# Altium schematic sheet interface.SchDoc
size A4; SheetNumber: 9; SheetTotal: 9; SPICEModelCacheBYCDXEOE: <root> / <DocumentId>BYCDXEOE</DocumentId> / <CacheFrame Number="0"> / <Model Name="1206_156120rs82500" Kind="CKT"> / <Text>****** / .subckt 1206_156120RS82500  1  2 / D1 1 2 SMRW / .MODEL SMRW D / + IS=404.38E-18 / + N=2.1466 / + RS=.75545 / + IKF=193.03E-6 / + CJO=1.0000E-12 / + M=.3333 / + VJ=.75 / + BV=5 / + IBV=100.00E-6 / + TT=5.0000E-9 / .ends</Text> / </Model> / </CacheFrame> / </root>
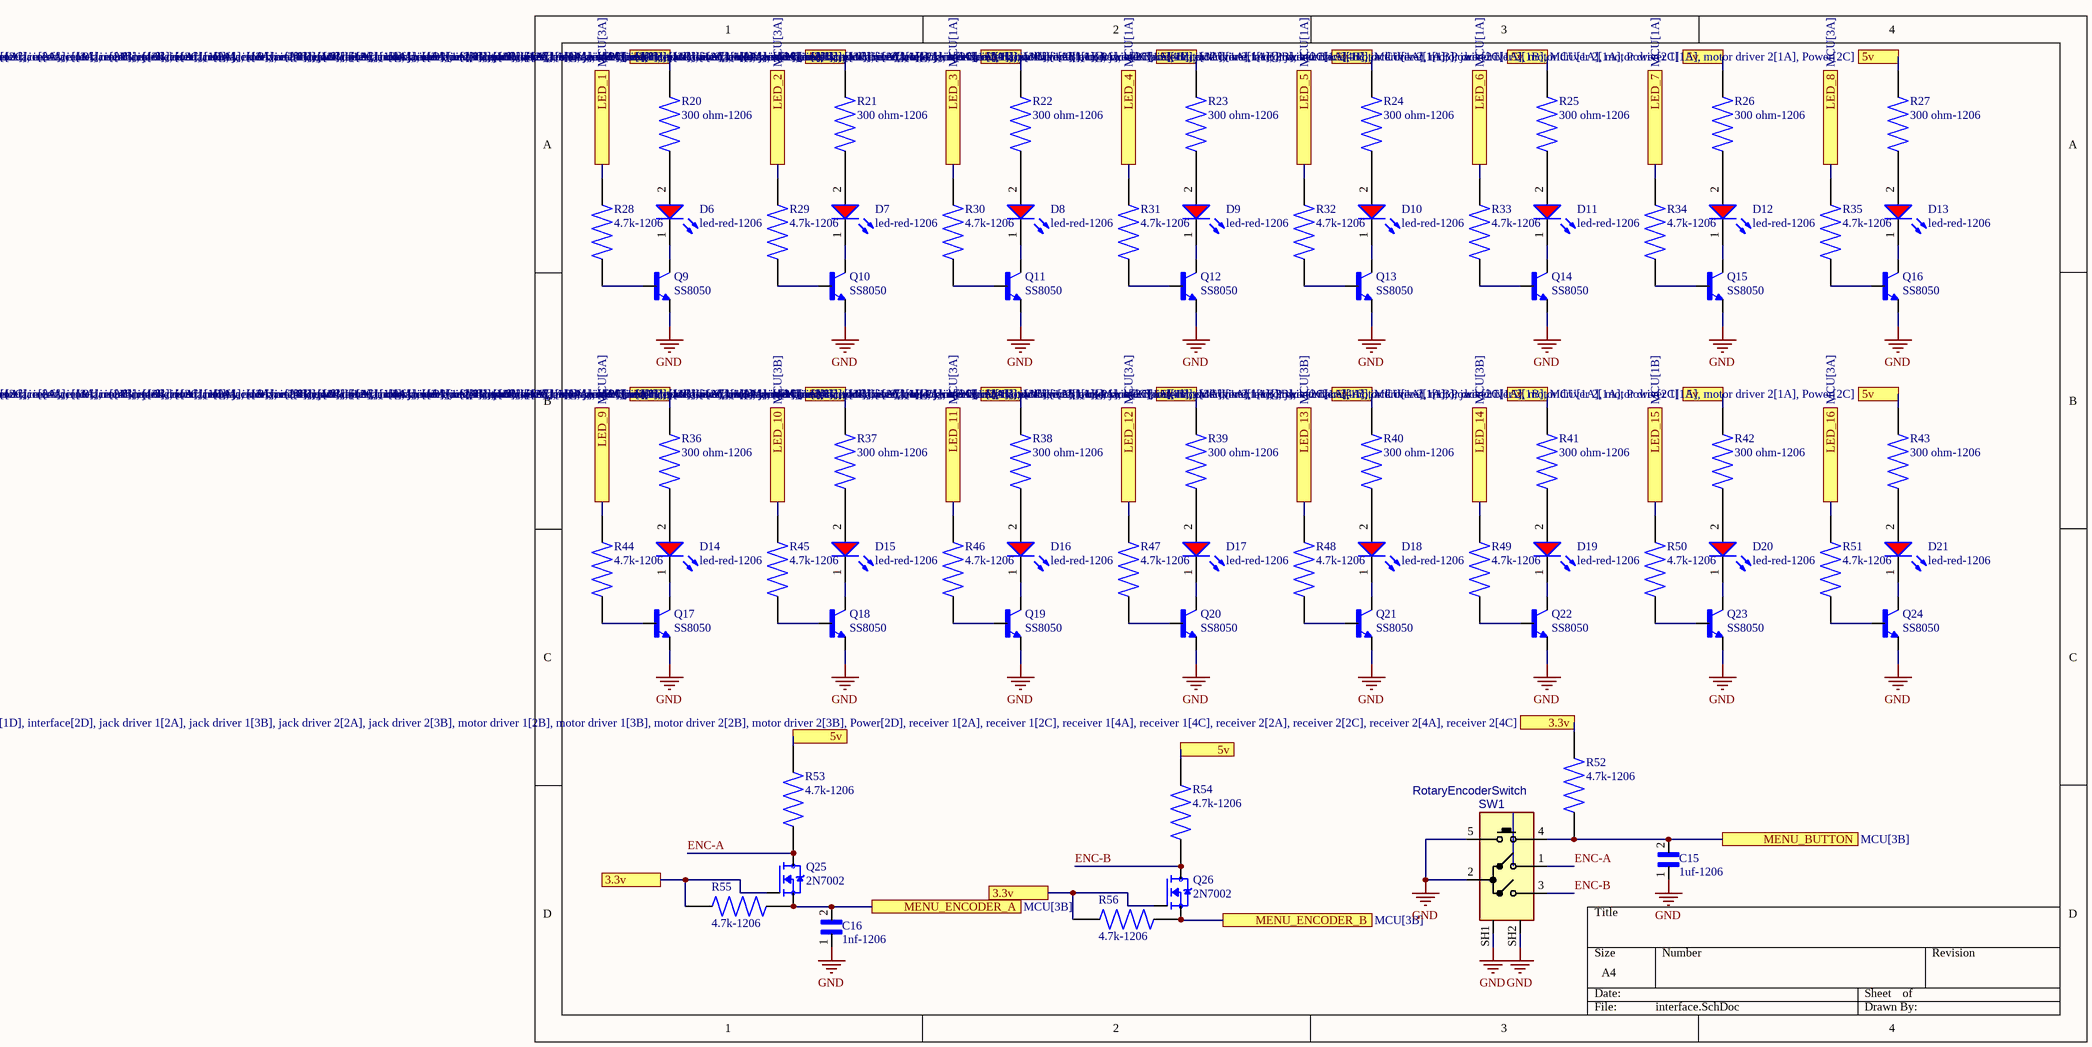
[diagram p0: interface.SchDoc]

## Parts
C15  1uf-1206  [CAPC3216X180N]
C16  1nf-1206  [CAPC3216X180N]
D6  led-red-1206  [WL-SMRW_1206 dome_normal use]
D7  led-red-1206  [WL-SMRW_1206 dome_normal use]
D8  led-red-1206  [WL-SMRW_1206 dome_normal use]
D9  led-red-1206  [WL-SMRW_1206 dome_normal use]
D10  led-red-1206  [WL-SMRW_1206 dome_normal use]
D11  led-red-1206  [WL-SMRW_1206 dome_normal use]
D12  led-red-1206  [WL-SMRW_1206 dome_normal use]
D13  led-red-1206  [WL-SMRW_1206 dome_normal use]
D14  led-red-1206  [WL-SMRW_1206 dome_normal use]
D15  led-red-1206  [WL-SMRW_1206 dome_normal use]
D16  led-red-1206  [WL-SMRW_1206 dome_normal use]
D17  led-red-1206  [WL-SMRW_1206 dome_normal use]
D18  led-red-1206  [WL-SMRW_1206 dome_normal use]
D19  led-red-1206  [WL-SMRW_1206 dome_normal use]
D20  led-red-1206  [WL-SMRW_1206 dome_normal use]
D21  led-red-1206  [WL-SMRW_1206 dome_normal use]
Q9  SS8050  [TRANS_SS8050-G]
Q10  SS8050  [TRANS_SS8050-G]
Q11  SS8050  [TRANS_SS8050-G]
Q12  SS8050  [TRANS_SS8050-G]
Q13  SS8050  [TRANS_SS8050-G]
Q14  SS8050  [TRANS_SS8050-G]
Q15  SS8050  [TRANS_SS8050-G]
Q16  SS8050  [TRANS_SS8050-G]
Q17  SS8050  [TRANS_SS8050-G]
Q18  SS8050  [TRANS_SS8050-G]
Q19  SS8050  [TRANS_SS8050-G]
Q20  SS8050  [TRANS_SS8050-G]
Q21  SS8050  [TRANS_SS8050-G]
Q22  SS8050  [TRANS_SS8050-G]
Q23  SS8050  [TRANS_SS8050-G]
Q24  SS8050  [TRANS_SS8050-G]
Q25  2N7002  [SOT95P240X111-3N]
Q26  2N7002  [SOT95P240X111-3N]
R20  300 ohm-1206  [RESC3015X65N]
R21  300 ohm-1206  [RESC3015X65N]
R22  300 ohm-1206  [RESC3015X65N]
R23  300 ohm-1206  [RESC3015X65N]
R24  300 ohm-1206  [RESC3015X65N]
R25  300 ohm-1206  [RESC3015X65N]
R26  300 ohm-1206  [RESC3015X65N]
R27  300 ohm-1206  [RESC3015X65N]
R28  4.7k-1206  [RESC3015X65N]
R29  4.7k-1206  [RESC3015X65N]
R30  4.7k-1206  [RESC3015X65N]
R31  4.7k-1206  [RESC3015X65N]
R32  4.7k-1206  [RESC3015X65N]
R33  4.7k-1206  [RESC3015X65N]
R34  4.7k-1206  [RESC3015X65N]
R35  4.7k-1206  [RESC3015X65N]
R36  300 ohm-1206  [RESC3015X65N]
R37  300 ohm-1206  [RESC3015X65N]
R38  300 ohm-1206  [RESC3015X65N]
R39  300 ohm-1206  [RESC3015X65N]
R40  300 ohm-1206  [RESC3015X65N]
R41  300 ohm-1206  [RESC3015X65N]
R42  300 ohm-1206  [RESC3015X65N]
R43  300 ohm-1206  [RESC3015X65N]
R44  4.7k-1206  [RESC3015X65N]
R45  4.7k-1206  [RESC3015X65N]
R46  4.7k-1206  [RESC3015X65N]
R47  4.7k-1206  [RESC3015X65N]
R48  4.7k-1206  [RESC3015X65N]
R49  4.7k-1206  [RESC3015X65N]
R50  4.7k-1206  [RESC3015X65N]
R51  4.7k-1206  [RESC3015X65N]
R52  4.7k-1206  [RESC3015X65N]
R53  4.7k-1206  [RESC3015X65N]
R54  4.7k-1206  [RESC3015X65N]
R55  4.7k-1206  [RESC3015X65N]
R56  4.7k-1206  [RESC3015X65N]
SW1  RotaryEncoderSwitch  [SWROT_11MM]

## Ports
3.3v (see interface[1D], interface[2D], jack driver 1[2A], jack driver 1[3B], jack driver 2[2A], jack driver 2[3B], motor driver 1[2B], motor driver 1[3B], motor driver 2[2B], motor driver 2[3B], Power[2D], receiver 1[2A], receiver 1[2C], receiver 1[4A], receiver 1[4C], receiver 2[2A], receiver 2[2C], receiver 2[4A], receiver 2[4C]), 3.3v (see interface[1D], interface[3C], jack driver 1[2A], jack driver 1[3B], jack driver 2[2A], jack driver 2[3B], motor driver 1[2B], motor driver 1[3B], motor driver 2[2B], motor driver 2[3B], Power[2D], receiver 1[2A], receiver 1[2C], receiver 1[4A], receiver 1[4C], receiver 2[2A], receiver 2[2C], receiver 2[4A], receiver 2[4C]), 3.3v (see interface[2D], interface[3C], jack driver 1[2A], jack driver 1[3B], jack driver 2[2A], jack driver 2[3B], motor driver 1[2B], motor driver 1[3B], motor driver 2[2B], motor driver 2[3B], Power[2D], receiver 1[2A], receiver 1[2C], receiver 1[4A], receiver 1[4C], receiver 2[2A], receiver 2[2C], receiver 2[4A], receiver 2[4C]), 5v (see interface[1A], interface[1B], interface[1C], interface[2A], interface[2B], interface[2C], interface[3A], interface[3B], interface[4A], interface[4B], jack driver 1[1B], jack driver 2[1B], MCU[1A], motor driver 1[1A], motor driver 2[1A], Power[2C]), 5v (see interface[1A], interface[1B], interface[1C], interface[2A], interface[2B], interface[2C], interface[3A], interface[3B], interface[4A], jack driver 1[1B], jack driver 2[1B], MCU[1A], motor driver 1[1A], motor driver 2[1A], Power[2C]), 5v (see interface[1A], interface[1B], interface[1C], interface[2A], interface[2B], interface[2C], interface[3A], interface[3B], interface[4B], jack driver 1[1B], jack driver 2[1B], MCU[1A], motor driver 1[1A], motor driver 2[1A], Power[2C]), 5v (see interface[1A], interface[1B], interface[1C], interface[2A], interface[2B], interface[3A], interface[3B], interface[4A], interface[4B], jack driver 1[1B], jack driver 2[1B], MCU[1A], motor driver 1[1A], motor driver 2[1A], Power[2C]), 5v (see interface[1A], interface[1B], interface[2A], interface[2B], interface[2C], interface[3A], interface[3B], interface[4A], interface[4B], jack driver 1[1B], jack driver 2[1B], MCU[1A], motor driver 1[1A], motor driver 2[1A], Power[2C]), LED_1 (see MCU[3A]), LED_2 (see MCU[3A]), LED_3 (see MCU[1A]), LED_4 (see MCU[1A]), LED_5 (see MCU[1A]), LED_6 (see MCU[1A]), LED_7 (see MCU[1A]), LED_8 (see MCU[3A]), LED_9 (see MCU[3A]), LED_10 (see MCU[3B]), LED_11 (see MCU[3A]), LED_12 (see MCU[3A]), LED_13 (see MCU[3B]), LED_14 (see MCU[3B]), LED_15 (see MCU[1B]), LED_16 (see MCU[3A]), MENU_BUTTON (see MCU[3B]), MENU_ENCODER_A (see MCU[3B]), MENU_ENCODER_B (see MCU[3B])

## Nets
GND: C15.1 C16.1 Q9.2(E) Q10.2(E) Q11.2(E) Q12.2(E) Q13.2(E) Q14.2(E) Q15.2(E) Q16.2(E) Q17.2(E) Q18.2(E) Q19.2(E) Q20.2(E) Q21.2(E) Q22.2(E) Q23.2(E) Q24.2(E) SW1.2(C) SW1.5(D) SW1.SH1 SW1.SH2
3.3v: Q25.1(G) Q26.1(G) R52.2 R55.1 R56.2 ; port 3.3v
5v: R20.2 R21.2 R22.2 R23.2 R24.2 R25.2 R26.2 R27.2 R36.2 R37.2 R38.2 R39.2 R40.2 R41.2 R42.2 R43.2 R53.2 R54.2 ; port 5v
ENC-A: Q25.3(D) R53.1 SW1.1(A)
ENC-B: Q26.3(D) R54.1 SW1.3(B)
LED_1: R28.2 ; port LED_1
LED_2: R29.2 ; port LED_2
LED_3: R30.2 ; port LED_3
LED_4: R31.2 ; port LED_4
LED_5: R32.2 ; port LED_5
LED_6: R33.2 ; port LED_6
LED_7: R34.2 ; port LED_7
LED_8: R35.2 ; port LED_8
LED_9: R44.2 ; port LED_9
LED_10: R45.2 ; port LED_10
LED_11: R46.2 ; port LED_11
LED_12: R47.2 ; port LED_12
LED_13: R48.2 ; port LED_13
LED_14: R49.2 ; port LED_14
LED_15: R50.2 ; port LED_15
LED_16: R51.2 ; port LED_16
MENU_BUTTON: C15.2 R52.1 SW1.4(E) ; port MENU_BUTTON
MENU_ENCODER_A: C16.2 Q25.2(S) R55.2 ; port MENU_ENCODER_A
MENU_ENCODER_B: Q26.2(S) R56.1 ; port MENU_ENCODER_B
NetD6_1: D6.1(K) Q9.3(C)
NetD6_2: D6.2(A) R20.1
NetD7_1: D7.1(K) Q10.3(C)
NetD7_2: D7.2(A) R21.1
NetD8_1: D8.1(K) Q11.3(C)
NetD8_2: D8.2(A) R22.1
NetD9_1: D9.1(K) Q12.3(C)
NetD9_2: D9.2(A) R23.1
NetD10_1: D10.1(K) Q13.3(C)
NetD10_2: D10.2(A) R24.1
NetD11_1: D11.1(K) Q14.3(C)
NetD11_2: D11.2(A) R25.1
NetD12_1: D12.1(K) Q15.3(C)
NetD12_2: D12.2(A) R26.1
NetD13_1: D13.1(K) Q16.3(C)
NetD13_2: D13.2(A) R27.1
NetD14_1: D14.1(K) Q17.3(C)
NetD14_2: D14.2(A) R36.1
NetD15_1: D15.1(K) Q18.3(C)
NetD15_2: D15.2(A) R37.1
NetD16_1: D16.1(K) Q19.3(C)
NetD16_2: D16.2(A) R38.1
NetD17_1: D17.1(K) Q20.3(C)
NetD17_2: D17.2(A) R39.1
NetD18_1: D18.1(K) Q21.3(C)
NetD18_2: D18.2(A) R40.1
NetD19_1: D19.1(K) Q22.3(C)
NetD19_2: D19.2(A) R41.1
NetD20_1: D20.1(K) Q23.3(C)
NetD20_2: D20.2(A) R42.1
NetD21_1: D21.1(K) Q24.3(C)
NetD21_2: D21.2(A) R43.1
NetQ9_1: Q9.1(B) R28.1
NetQ10_1: Q10.1(B) R29.1
NetQ11_1: Q11.1(B) R30.1
NetQ12_1: Q12.1(B) R31.1
NetQ13_1: Q13.1(B) R32.1
NetQ14_1: Q14.1(B) R33.1
NetQ15_1: Q15.1(B) R34.1
NetQ16_1: Q16.1(B) R35.1
NetQ17_1: Q17.1(B) R44.1
NetQ18_1: Q18.1(B) R45.1
NetQ19_1: Q19.1(B) R46.1
NetQ20_1: Q20.1(B) R47.1
NetQ21_1: Q21.1(B) R48.1
NetQ22_1: Q22.1(B) R49.1
NetQ23_1: Q23.1(B) R50.1
NetQ24_1: Q24.1(B) R51.1

## Library data of the parts
C15 C16 = CGA5L3X8R1H105M160AB: 1ÂµF Â±20% 50V Ceramic Capacitor X8R 1206 (3216 Metric); MF: TDK; Value: *; Purchase-URL: https://pricing.snapeda.com/search/part/CGA5L3X8R1H105M160AB/?ref=eda; Package: 3216 TDK; Availability: In Stock; SnapEDA_Link: https://www.snapeda.com/parts/CGA5L3X8R1H105M160AB/TDK/view-part/?ref=snap; MP: CGA5L3X8R1H105M160AB; Check_prices: https://www.snapeda.com/parts/CGA5L3X8R1H105M160AB/TDK/view-part/?ref=eda; Price: None
D6-D21 = 156120RS82500: WL-SMRW Mono-color Reverse mount Waterclear, SMT, size 1206 dome, Red, 2V, 20°; Manufacturer: Wurth Elektronik; Chip Technology: AlInGaP; Dominant Wavelength: 624nm; Luminous Intensity: 1100mcd; Peak Wavelength: 632nm; Manufacturer Part Number: 156120RS82500; Category: Signal LEDs; Match Code: WL-SMRW; ComponentLink1Description: Website Link; ComponentLink1URL: https://www.we-online.com/redexpert/article/156120RS82500?ad; ComponentLink2Description: Datasheet Link; ComponentLink2URL: https://www.we-online.com/redexpert/spec/156120RS82500?ad; Mount: Surface Mount; Operating Temperature Max: 85°C; Operating Temperature Min: -40°C; Packaging: Tape and Reel; Case/Size Code: 1206 dome; Length: 3.2mm; Width: 1.6mm; Height: 1.85mm; Emitting Color: Red; Forward Voltage: 2V; Viewing Angle: 20°
Q9-Q24 = SS8050-G: Bipolar (BJT) Transistor NPN 25 V 1.5 A 100MHz 300 mW Surface Mount SOT-23-3; MP: SS8050G; MF: Comchip; Digi-Key_Part_Number: 641-1790-2-ND; Check_prices: https://www.snapeda.com/parts/SS8050G/Comchip/view-part/?ref=eda; Package: None; SnapEDA_Link: https://www.snapeda.com/parts/SS8050G/Comchip/view-part/?ref=snap; Value: *
Q25 Q26 = 2N7002: N-Channel 60V 280mA (Ta) 350mW (Ta) Surface Mount SOT-23-3 (TO-236); MF: {'manufacturer': u'onsemi'}; Package: None; Price: None; Value: *; MP: 2N7002; Availability: Unavailable
R20-R56 = CPF1206B10KE1: Res Thin Film 1206 10K Ohm 0.1% 1/8W Â±25ppm/Â°C Molded SMD SMD Paper T/R; Power_Rating: .125 W; MF: TE Connectivity; Voltage_Rating: 150 V; Tolerance: .1%; SnapEDA_Link: https://www.snapeda.com/parts/CPF1206B10KE1/TE+Connectivity/view-part/?ref=snap; Package: 1206; Resistance: 10K; Value: *; MP: CPF1206B10KE1; EU_RoHS_Compliance: Compliant; Check_prices: https://www.snapeda.com/parts/CPF1206B10KE1/TE+Connectivity/view-part/?ref=eda
SW1 = SWROT_11MM: SWITCH, ROTARY Encoder, 11mm Metal Shaft; MANF_PART#: RE111F-41B3N-15F-20P; MANF: Alpha; DESC: DESCRIPTION; ASSEMBLY: ASSEMBLY; PARAM: PARAM; PRICE: -; VALUE: RotaryEncoderSwitch